# EasyEDA Pro project Tracking-Car.eprj

# Schematic Tracking-Car
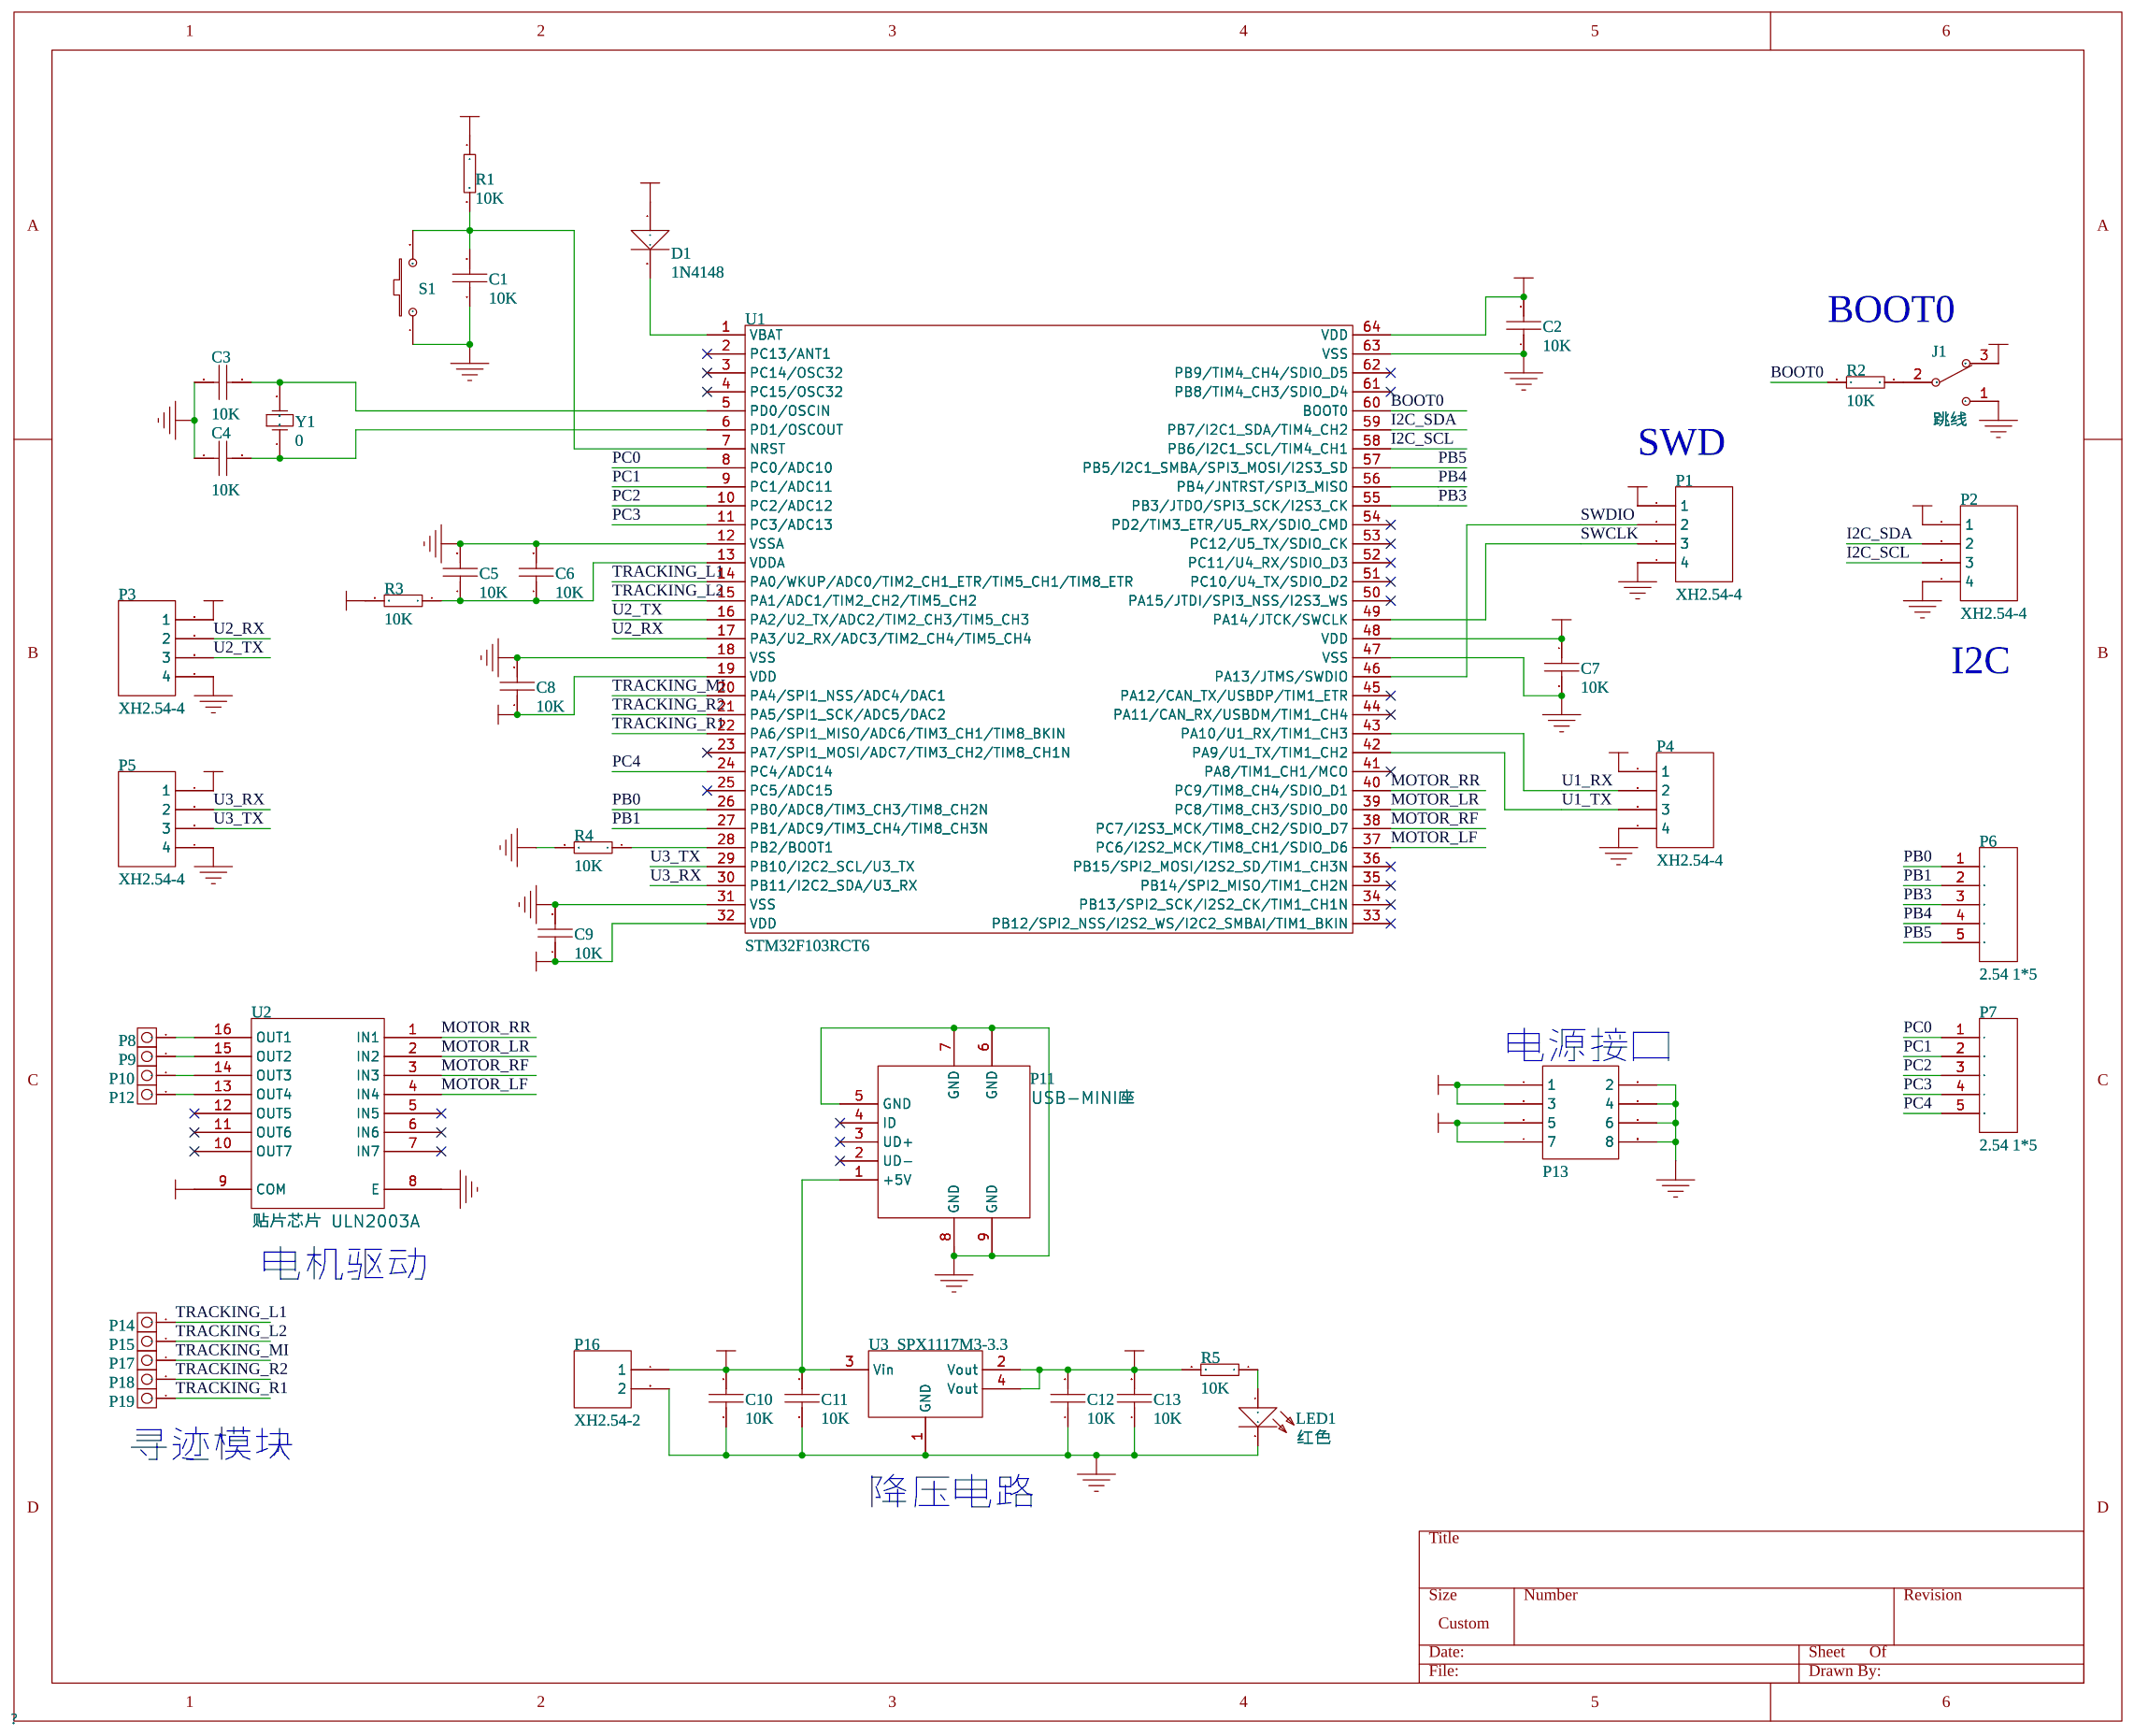
[diagram p0: schematic sheet]

## Parts
C1  10K  [R0805]
C2  10K  [R0805]
C3  10K  [R0805]
C4  10K  [R0805]
C5  10K  [R0805]
C6  10K  [R0805]
C7  10K  [R0805]
C8  10K  [R0805]
C9  10K  [R0805]
C10  10K  [R0805]
C11  10K  [R0805]
C12  10K  [R0805]
C13  10K  [R0805]
D1  1N4148  [Ƭ IN4148]
J1  跳线  [Ų 2.54 1*3]
LED1  红色  [LED0805]
P1  XH2.54-4  [VH2.54_4]
P2  XH2.54-4  [VH2.54_4]
P3  XH2.54-4  [VH2.54_4]
P4  XH2.54-4  [VH2.54_4]
P5  XH2.54-4  [VH2.54_4]
P6  2.54 1*5  [Ų 2.54 1*5]
P7  2.54 1*5  [Ų 2.54 1*5]
P8  DZ254R-11-01-63  [HDR-TH_1P-P2.54-V-M]
P9  DZ254R-11-01-63  [HDR-TH_1P-P2.54-V-M]
P10  DZ254R-11-01-63  [HDR-TH_1P-P2.54-V-M]
P11  USB-MINI座  [USB MINI DIP]
P12  DZ254R-11-01-63  [HDR-TH_1P-P2.54-V-M]
P13  双排插针 2.54 2*4  [HDR-TH_8P-P2.54-V-F-R2-C4-S2.54-1]
P14  DZ254R-11-01-63  [HDR-TH_1P-P2.54-V-M]
P15  DZ254R-11-01-63  [HDR-TH_1P-P2.54-V-M]
P16  XH2.54-2  [VH2.54_2]
P17  DZ254R-11-01-63  [HDR-TH_1P-P2.54-V-M]
P18  DZ254R-11-01-63  [HDR-TH_1P-P2.54-V-M]
P19  DZ254R-11-01-63  [HDR-TH_1P-P2.54-V-M]
R1  10K  [R0805]
R2  10K  [R0805]
R3  10K  [R0805]
R4  10K  [R0805]
R5  10K  [R0805]
S1  key  [ᴥ  6*3]
U1  STM32F103RCT6  [LQFP64]
U2  贴片芯片 ULN2003A  [SOIC16]
U3  SPX1117M3-3.3  [SOT223]
Y1  0  [BCY-W2/E4.7]

## Library data of the parts
C1-C13 = 10K: Supplier Part: C9900011271; JLCPCB Part Class: Extended Part; Supplier: LCSC; Design Item ID: 电容 贴片 0805; Library Name: Sch_Device_veryaz; 名称: 贴片电容; 封装: 0805; 单位: 个
D1 = 1N4148: 名称: 贴片二极管; 封装: 贴片; 单位: 个; Design Item ID: 二极管 贴片 1N4148; Library Name: Sch_Device_veryaz
J1 = 跳线: 单位: 个; 封装: 直插; 名称: 跳线插针; Design Item ID: 联结件 跳线端子 2.54-3; Library Name: Sch_Device_veryaz
LED1 = 红色: 名称: 贴片发光二极管; 封装: 0805; 单位: 个; Design Item ID: 二极管 贴片发光 0805; Library Name: Sch_Device_veryaz
P1-P5 = XH2.54-4: 名称: 联结件; 单位: 套; Design Item ID: 联结件 XH2.54-4; Library Name: Sch_Device_veryaz
P6 P7 = 2.54 1*5: 单位: 片; 封装: DIP; 名称: 单排插针; Design Item ID: 联结件 单排插针 2.54 1*5; Library Name: Sch_Device_veryaz
P8-P10 P12 P14 P15 P17-P19 = DZ254R-11-01-63: LCSC Part Name: 1x1P P=2.54mm 排针; Supplier Part: C2998932; Manufacturer: DEALON(德艺隆); Supplier Footprint: 插件,P=2.54mm; JLCPCB Part Class: Extended Part; Datasheet: https://atta.szlcsc.com/upload/public/pdf/source/20211231/575FA3133C71038A037ABECAE7869EE6.pdf; Supplier: LCSC; Design Item ID: 焊盘; Library Name: Sch_Device_veryaz; 单位: 个; 名称: 焊盘; 封装: 直插
P11 = USB-MINI座: 单位: 个; 封装: 440068; 名称: 联结件; Design Item ID: 联结件 USB-MINI座; Library Name: Sch_Device_veryaz
P13 = HDR-F_2.54_2x4: Supplier Part: C92271; Supplier Footprint: 插件; Design Item ID: 联结件 双排插针 2.54 2*4; Library Name: Sch_Device_veryaz; 名称: 联结件; 单位: 个; 封装: 直插
P16 = XH2.54-2: 名称: 联结件; 封装: VH3.96-2; 单位: 套; Design Item ID: 联结件 XH2.54-2; Library Name: Sch_Device_veryaz
R1-R5 = 10K: Supplier Part: C9900011271; JLCPCB Part Class: Extended Part; Supplier: LCSC; Design Item ID: 电阻 贴片 0805; Library Name: Sch_Device_veryaz; 名称: 贴片电阻; 封装: 0805; 单位: 个
S1 = key: 单位: 个; 名称: 开关; 封装: 直插 12*12*12; Design Item ID: 按键 轻触 3*6; Library Name: Sch_Device_veryaz
U1 = STM32F103RCT6: 单片机; 名称: 芯片; 单位: 片; Design Item ID: 贴片芯片 STM32F103RCT6; Library Name: Sch_Device_veryaz
U2 = 贴片芯片 ULN2003A: 单位: 片; 名称: 贴片芯片; Library Name: Sch_Device_veryaz
U3 = SPX1117M3-3.3: LDO; 名称: 贴片芯片; 单位: 个; Design Item ID: 贴片芯片 SPX1117M3-3.3; Library Name: Sch_Device_veryaz
Y1 = 0: 名称: 晶振; 封装: 直插矮; 单位: 个; Design Item ID: 晶振 直插矮; Library Name: Sch_Device_veryaz

## Nets
3.3V: C2.2 C7.1 C8.1 C9.1 C12.2 C13.2 D1.1(A) J1.3 P1.1 P2.1 P3.1 P4.1 P5.1 P13.1 P13.3 R1.1 R3.2 R5.2 U1.19(VDD) U1.32(VDD) U1.48(VDD) U1.64(VDD) U3.2(Vout) U3.4(Vout)
5V: C10.2 C11.2 P11.1(+5V) P13.5 P13.7 P16.1 U2.9(COM) U3.3(Vin)
GND: C1.1 C2.1 C3.1 C4.1 C5.2 C6.2 C7.2 C8.2 C9.2 C10.1 C11.1 C12.1 C13.1 J1.1 LED1.2(K) P1.4 P2.4 P3.4 P4.4 P5.4 P11.5(GND) P11.6(GND) P11.7(GND) P11.8(GND) P11.9(GND) P13.2 P13.4 P13.6 P13.8 P16.2 R4.2 S1.1 U1.12(VSSA) U1.18(VSS) U1.31(VSS) U1.47(VSS) U1.63(VSS) U2.8(E) U3.1(GND)
BOOT0: R2.2 U1.60(BOOT0)
I2C_SCL: P2.3 U1.58(PB6/I2C1_SCL/TIM4_CH1)
I2C_SDA: P2.2 U1.59(PB7/I2C1_SDA/TIM4_CH2)
MOTOR_LF: U1.37(PC6/I2S2_MCK/TIM8_CH1/SDIO_D6) U2.4(IN4)
MOTOR_LR: U1.39(PC8/TIM8_CH3/SDIO_D0) U2.2(IN2)
MOTOR_RF: U1.38(PC7/I2S3_MCK/TIM8_CH2/SDIO_D7) U2.3(IN3)
MOTOR_RR: U1.40(PC9/TIM8_CH4/SDIO_D1) U2.1(IN1)
PB0: P6.1 U1.26(PB0/ADC8/TIM3_CH3/TIM8_CH2N)
PB1: P6.2 U1.27(PB1/ADC9/TIM3_CH4/TIM8_CH3N)
PB3: P6.3 U1.55(PB3/JTDO/SPI3_SCK/I2S3_CK)
PB4: P6.4 U1.56(PB4/JNTRST/SPI3_MISO)
PB5: P6.5 U1.57(PB5/I2C1_SMBA/SPI3_MOSI/I2S3_SD)
PC0: P7.1 U1.8(PC0/ADC10)
PC1: P7.2 U1.9(PC1/ADC11)
PC2: P7.3 U1.10(PC2/ADC12)
PC3: P7.4 U1.11(PC3/ADC13)
PC4: P7.5 U1.24(PC4/ADC14)
SWCLK: P1.3 U1.49(PA14/JTCK/SWCLK)
SWDIO: P1.2 U1.46(PA13/JTMS/SWDIO)
TRACKING_L1: P14.1 U1.14(PA0/WKUP/ADC0/TIM2_CH1_ETR/TIM5_CH1/TIM8_ETR)
TRACKING_L2: P15.1 U1.15(PA1/ADC1/TIM2_CH2/TIM5_CH2)
TRACKING_MI: P17.1 U1.20(PA4/SPI1_NSS/ADC4/DAC1)
TRACKING_R1: P19.1 U1.22(PA6/SPI1_MISO/ADC6/TIM3_CH1/TIM8_BKIN)
TRACKING_R2: P18.1 U1.21(PA5/SPI1_SCK/ADC5/DAC2)
U1_RX: P4.2 U1.43(PA10/U1_RX/TIM1_CH3)
U1_TX: P4.3 U1.42(PA9/U1_TX/TIM1_CH2)
U2_RX: P3.2 U1.17(PA3/U2_RX/ADC3/TIM2_CH4/TIM5_CH4)
U2_TX: P3.3 U1.16(PA2/U2_TX/ADC2/TIM2_CH3/TIM5_CH3)
U3_RX: P5.2 U1.30(PB11/I2C2_SDA/U3_RX)
U3_TX: P5.3 U1.29(PB10/I2C2_SCL/U3_TX)
$1N727: C5.1 C6.1 R3.1 U1.13(VDDA)
$1N732: R4.1 U1.28(PB2/BOOT1)
$1N742: D1.2(K) U1.1(VBAT)
$1N823: LED1.1(A) R5.1
Net-(C1-2): C1.2 R1.2 S1.2 U1.7(NRST)
Net-(C3-2): C3.2 U1.5(PD0/OSCIN) Y1.2(OSC2)
Net-(C4-2): C4.2 U1.6(PD1/OSCOUT) Y1.1(OSC1)
Net-(J1-2): J1.2 R2.1
Net-(P8-1): P8.1 U2.16(OUT1)
Net-(P9-1): P9.1 U2.15(OUT2)
Net-(P10-1): P10.1 U2.14(OUT3)
Net-(P12-1): P12.1 U2.13(OUT4)

Not connected (* = marked no-connect by the designer): P11 2(UD-)* 3(UD+)* 4(ID)*; U1 2(PC13/ANT1)* 3(PC14/OSC32)* 4(PC15/OSC32)* 23(PA7/SPI1_MOSI/ADC7/TIM3_CH2/TIM8_CH1N)* 25(PC5/ADC15)* 33(PB12/SPI2_NSS/I2S2_WS/I2C2_SMBAI/TIM1_BKIN)* 34(PB13/SPI2_SCK/I2S2_CK/TIM1_CH1N)* 35(PB14/SPI2_MISO/TIM1_CH2N)* 36(PB15/SPI2_MOSI/I2S2_SD/TIM1_CH3N)* 41(PA8/TIM1_CH1/MCO)* 44(PA11/CAN_RX/USBDM/TIM1_CH4)* 45(PA12/CAN_TX/USBDP/TIM1_ETR)* 50(PA15/JTDI/SPI3_NSS/I2S3_WS)* 51(PC10/U4_TX/SDIO_D2)* 52(PC11/U4_RX/SDIO_D3)* 53(PC12/U5_TX/SDIO_CK)* 54(PD2/TIM3_ETR/U5_RX/SDIO_CMD)* 61(PB8/TIM4_CH3/SDIO_D4)* 62(PB9/TIM4_CH4/SDIO_D5)*; U2 5(IN5)* 6(IN6)* 7(IN7)* 10(OUT7)* 11(OUT6)* 12(OUT5)*

## Notes on the sheet
- BOOT0
- SWD
- I2C
- 电源接口
- 电机驱动
- 寻迹模块
- 降压电路

# Board Tracking-Car
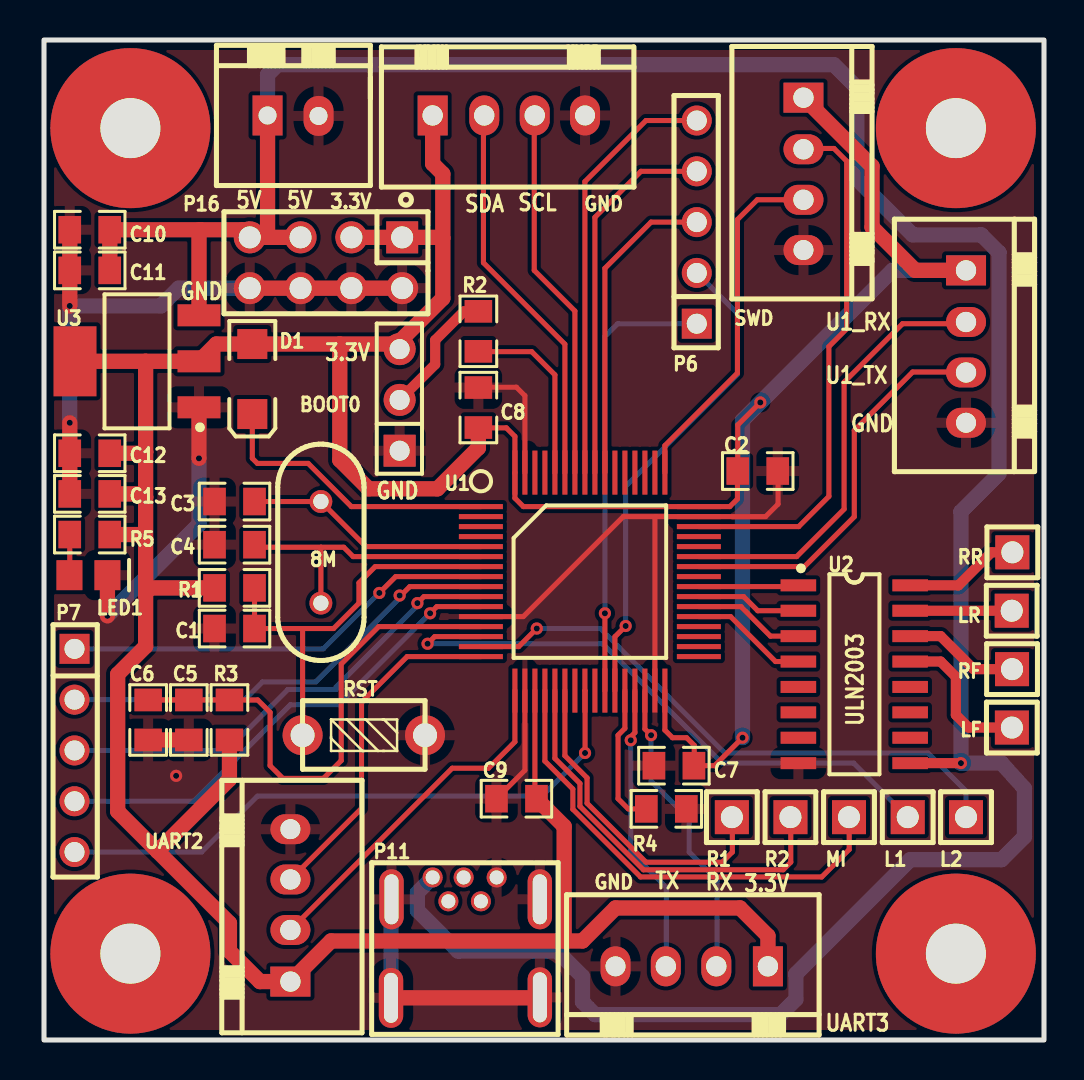
[diagram p1: board, top side]
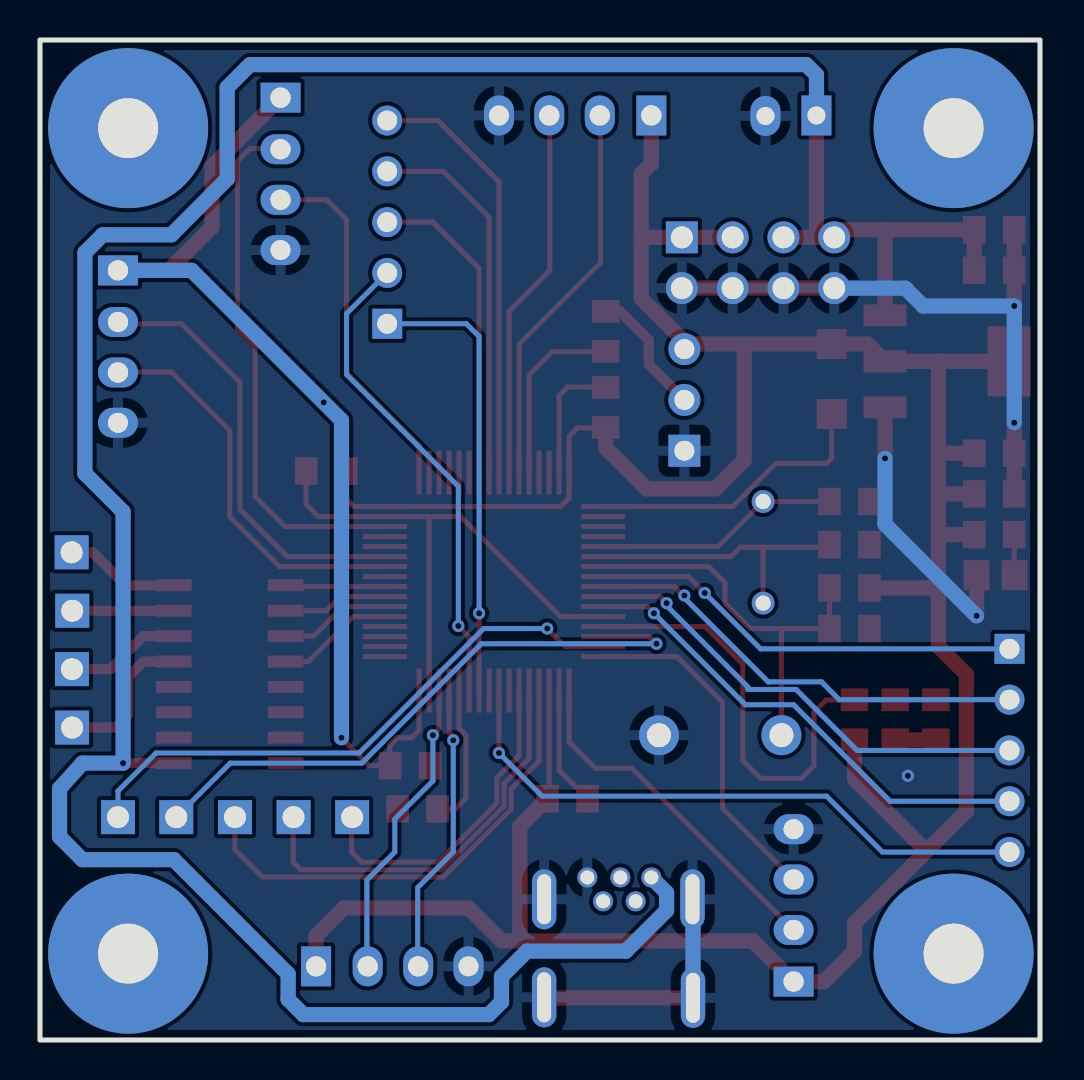
[diagram p2: board, bottom side, seen from below]

Outline 50 x 50 mm; copper layers: Top Layer, Bottom Layer. Coordinates in mm from the lower left corner of the outline.
Outline path: rectangle 0,50 50,0
Stack: Top Layer 0.035mm / Dielectric1 1.51mm FR4 er 4.5 / Bottom Layer 0.035mm

## Design rules (mm)
template: 自定义配置
spacing copperThickness1oz (default): track to track 0.102, other pairs 0.152 to 0.3
spacing copperThickness2oz: track to track 0.203, other pairs 0.152 to 0.3
track width copperThickness1oz (default): min 0.127, default 0.254, max 2.54
track width copperThickness2oz: min 0.203, default 0.254, max 2.54
track width VCC: min 0.254, default 0.508, max 2.54
track width GND: min 0.254, default 0.508, max 2.54
differential pair differentialPair (default): width min 0.127, default 0.254, max 2.54; gap min 0.152, default 0.152
via viaSize (default): diameter min 0.5, default 0.61, max 10; hole min 0.3, default 0.305, max 6.299
net 3.3V uses VCC
net 5V uses VCC

## Placement (name value [footprint] x y rotation side)
3.3V  双排插针 2.54 2*4  [HDR-TH_8P-P2.54-V-F-R2-C4-S2.54-1]  14.1 38.86 180 top
8M  0  [BCY-W2/E4.7]  13.84 21.84 90 top
BOOT0  跳线  [Ų 2.54 1*3]  17.78 29.46 90 top
C1  10K  [R0805]  9.53 20.57 0 top
C2  10K  [R0805]  35.69 28.45 180 top
C3  10K  [R0805]  9.53 26.92 0 top
C4  10K  [R0805]  9.53 24.77 0 top
C5  10K  [R0805]  7.24 16 270 top
C6  10K  [R0805]  5.21 16 270 top
C7  10K  [R0805]  31.5 13.72 180 top
C8  10K  [R0805]  21.72 31.62 90 top
C9  10K  [R0805]  23.62 12.06 180 top
C10  10K  [R0805]  2.29 40.51 0 top
C11  10K  [R0805]  2.29 38.48 0 top
C12  10K  [R0805]  2.29 29.34 0 top
C13  10K  [R0805]  2.29 27.3 0 top
D1  1N4148  [Ƭ IN4148]  10.41 34.8 270 top
GND  -  [VH2.54_4]  36.19 3.68 0 top
GND#2  -  [VH2.54_4]  19.43 46.23 180 top
L1  DZ254R-11-01-63  [HDR-TH_1P-P2.54-V-M]  43.19 11.14 0 top
L2  DZ254R-11-01-63  [HDR-TH_1P-P2.54-V-M]  46.1 11.14 0 top
LED1  红色  [LED0805]  1.27 23.24 0 top
LF  DZ254R-11-01-63  [HDR-TH_1P-P2.54-V-M]  48.39 15.62 0 top
LR  DZ254R-11-01-63  [HDR-TH_1P-P2.54-V-M]  48.39 21.46 0 top
MI  DZ254R-11-01-63  [HDR-TH_1P-P2.54-V-M]  40.25 11.14 0 top
NOREF  -  [Pad_e104]  4.32 45.59 0 top
NOREF#2  -  [Pad_e110]  45.59 45.59 0 top
NOREF#3  -  [Pad_e112]  4.32 4.32 0 top
NOREF#4  -  [Pad_e111]  45.59 4.32 0 top
P6  2.54 1*5  [Ų 2.54 1*5]  32.64 35.81 90 top
P7  2.54 1*5  [Ų 2.54 1*5]  1.52 19.56 270 top
P11  USB-MINI座  [USB MINI DIP]  19.43 8.13 90 top
P16  XH2.54-2  [VH2.54_2]  11.18 46.23 180 top
R1  10K  [R0805]  9.53 22.61 0 top
R1#2  -  [HDR-TH_1P-P2.54-V-M]  34.39 11.14 0 top
R2  10K  [R0805]  21.72 35.43 270 top
R2#2  -  [HDR-TH_1P-P2.54-V-M]  37.32 11.14 0 top
R3  10K  [R0805]  9.27 16 270 top
R4  10K  [R0805]  31.12 11.56 0 top
R5  10K  [R0805]  2.29 25.27 0 top
RF  DZ254R-11-01-63  [HDR-TH_1P-P2.54-V-M]  48.4 18.54 0 top
RR  DZ254R-11-01-63  [HDR-TH_1P-P2.54-V-M]  48.42 24.38 0 top
RST  key  [ᴥ  6*3]  19.05 15.24 270 top
SWD  XH2.54-4  [VH2.54_4]  37.97 47.12 90 top
U1  STM32F103RCT6  [LQFP64]  21.84 26.67 0 top
U2  贴片芯片 ULN2003A  [SOIC16]  37.85 22.73 270 top
U3  SPX1117M3-3.3  [SOT223]  7.75 31.62 90 top
UART2  XH2.54-4  [VH2.54_4]  12.32 2.92 270 top
USART1  XH2.54-4  [VH2.54_4]  46.1 38.48 90 top

## Footprints (pads in the part's own frame, mm; a bottom-side part is the same pattern mirrored in y, then rotated)
BCY-W2/E4.7
  round 1.143 hole 0.762: 1(0,0) 2(5.08,0)
HDR-TH_1P-P2.54-V-M
  rect 1.7x1.7 hole 1.1: 1(0,0)
HDR-TH_8P-P2.54-V-F-R2-C4-S2.54-1
  rect 1.6x1.6 hole 1.1: 1(-3.81,-1.27)
  round 1.6 hole 1.1: 2(-3.81,1.27) 3(-1.27,-1.27) 4(-1.27,1.27) 5(1.27,-1.27) 6(1.27,1.27) 7(3.81,-1.27) 8(3.81,1.27)
LED0805
  rect 1.3x1.5 smd: 1(0,0) 2(1.9,0)
LQFP64
  rect 2.2x0.254 smd: 1(0,0) 2(0,-0.5) 3(0,-1) 4(0,-1.5) 5(0,-2) 6(0,-2.5) 7(0,-3) 8(0,-3.5) 9(0,-4) 10(0,-4.5) 11(0,-5) 12(0,-5.5) 13(0,-6) 14(0,-6.5) 15(0,-7) 16(0,-7.5) 33(10.9,-7.5) 34(10.9,-7) 35(10.9,-6.5) 36(10.9,-6) 37(10.9,-5.5) 38(10.9,-5) 39(10.9,-4.5) 40(10.9,-4) 41(10.9,-3.5) 42(10.9,-3) 43(10.9,-2.5) 44(10.9,-2) 45(10.9,-1.5) 46(10.9,-1) 47(10.9,-0.5) 48(10.9,0)
  rect 0.254x2.2 smd: 17(1.7,-9.2) 18(2.2,-9.2) 19(2.7,-9.2) 20(3.2,-9.2) 21(3.7,-9.2) 22(4.2,-9.2) 23(4.7,-9.2) 24(5.2,-9.2) 25(5.7,-9.2) 26(6.2,-9.2) 27(6.7,-9.2) 28(7.2,-9.2) 29(7.7,-9.2) 30(8.2,-9.2) 31(8.7,-9.2) 32(9.2,-9.2) 49(9.2,1.7) 50(8.7,1.7) 51(8.2,1.7) 52(7.7,1.7) 53(7.2,1.7) 54(6.7,1.7) 55(6.2,1.7) 56(5.7,1.7) 57(5.2,1.7) 58(4.7,1.7) 59(4.2,1.7) 60(3.7,1.7) 61(3.2,1.7) 62(2.7,1.7) 63(2.2,1.7) 64(1.7,1.7)
Pad_e104
  round 8 hole 3: 1(0,0)
Pad_e110
  round 8 hole 3: 2(0,0)
Pad_e111
  round 8 hole 3: 3(0,0)
Pad_e112
  round 8 hole 3: 4(0,0)
R0805
  rect 1.133x1.377 smd: 1(-1,0) 2(1,0)
SOIC16
  rect 0.6x1.778 smd: 1(0,-0.127) 2(1.27,-0.127) 3(2.54,-0.127) 4(3.81,-0.127) 5(5.08,-0.127) 6(6.35,-0.127) 7(7.62,-0.127) 8(8.89,-0.127) 9(8.89,5.461) 10(7.62,5.461) 11(6.35,5.461) 12(5.08,5.461) 13(3.81,5.461) 14(2.54,5.461) 15(1.27,5.461) 16(0,5.461)
SOT223
  rect 1.1x2.15 smd: 1(0.011,-0.001) 2(2.312,-0.001) 3(4.612,-0.001)
  rect 3.5x2.15 smd: 4(2.312,6.199)
USB MINI DIP
  round 1 hole 0.7: 1(0,0) 2(-1.194,-0.787) 3(0,-1.55) 4(-1.194,-2.413) 5(0,-3.2)
  oval 3x1.22 hole 2.5x0.7: 6(-1.093,-5.359) 7(-5.995,-5.36) 8(-1.093,2.057) 9(-6.02,2.082)
VH2.54_2
  rect 1.5x2 hole 0.9: 1(0,0)
  oval 1.5x2 hole 0.9: 2(-2.55,0.025)
VH2.54_4
  rect 1.5x2 hole 1.016: 1(0,0)
  oval 1.5x2 hole 1.016: 2(-2.58,0) 3(-5.106,0)
  oval 1.5x2 hole 1: 4(-7.62,0)
Ų 2.54 1*3
  rect 1.6x1.6 hole 1: 1(0,0)
  round 1.6 hole 1: 2(2.54,0) 3(5.08,0)
Ų 2.54 1*5
  rect 1.5x1.5 hole 1: 1(0,0)
  round 1.5 hole 1: 2(2.54,0) 3(5.08,0) 4(7.62,0) 5(10.16,0)
Ƭ IN4148
  rect 1.5x1.5 smd: 1(0,0) 2(3.5,0)
ᴥ  6*3
  round 2 hole 1.2: 1(0,0) 2(0,-6.122)

## Nets
3.3V: 3.3V.1 3.3V.3 BOOT0.3 C2.2 C7.1 C8.1 C9.1 C12.2 C13.2 D1.1 GND.1 GND#2.1 R1.1 R3.2 R5.2 SWD.1 U1.19 U1.32 U1.48 U1.64 U3.2 U3.4 UART2.1 USART1.1
5V: 3.3V.5 3.3V.7 C10.2 C11.2 P11.1 P16.1 U2.9 U3.3
GND: 3.3V.2 3.3V.4 3.3V.6 3.3V.8 BOOT0.1 C1.1 C2.1 C3.1 C4.1 C5.2 C6.2 C7.2 C8.2 C9.2 C10.1 C11.1 C12.1 C13.1 GND.4 GND#2.4 LED1.2 P11.5 P11.6 P11.7 P11.8 P11.9 P16.2 R4.2 RST.1 SWD.4 U1.12 U1.18 U1.31 U1.47 U1.63 U2.8 U3.1 UART2.4 USART1.4
BOOT0: R2.2 U1.60
I2C_SCL: GND#2.3 U1.58
I2C_SDA: GND#2.2 U1.59
MOTOR_LF: U1.37 U2.4
MOTOR_LR: U1.39 U2.2
MOTOR_RF: U1.38 U2.3
MOTOR_RR: U1.40 U2.1
PB0: P6.1 U1.26
PB1: P6.2 U1.27
PB3: P6.3 U1.55
PB4: P6.4 U1.56
PB5: P6.5 U1.57
PC0: P7.1 U1.8
PC1: P7.2 U1.9
PC2: P7.3 U1.10
PC3: P7.4 U1.11
PC4: P7.5 U1.24
SWCLK: SWD.3 U1.49
SWDIO: SWD.2 U1.46
TRACKING_L1: L1.1 U1.14
TRACKING_L2: L2.1 U1.15
TRACKING_MI: MI.1 U1.20
TRACKING_R1: R1#2.1 U1.22
TRACKING_R2: R2#2.1 U1.21
U1_RX: U1.43 USART1.2
U1_TX: U1.42 USART1.3
U2_RX: U1.17 UART2.2
U2_TX: U1.16 UART2.3
U3_RX: GND.2 U1.30
U3_TX: GND.3 U1.29
$1N727: C5.1 C6.1 R3.1 U1.13
$1N732: R4.1 U1.28
$1N739: C1.2 R1.2 RST.2 U1.7
$1N742: D1.2 U1.1
$1N759: RR.1 U2.16
$1N760: LR.1 U2.15
$1N761: RF.1 U2.14
$1N762: LF.1 U2.13
$1N823: LED1.1 R5.1
$1N832: 8M.1 C4.2 U1.6
$1N833: 8M.2 C3.2 U1.5
$1N910: BOOT0.2 R2.1

Pads without a net: NOREF 1; NOREF#2 2; NOREF#3 4; NOREF#4 3; P11 2 3 4; U1 2 3 4 23 25 33 34 35 36 41 44 45 50 51 52 53 54 61 62; U2 5 6 7 10 11 12

## Via types
v1: diameter 0.61, hole 0.305, Top Layer to Bottom Layer, 19 vias

## Routing (per net, layer and track width the routed paths; a pad name or vN(x,y) marks a point on that pad's centre or on a via; arc(x,y) is an arc through that point)
3.3V: length 215.3
  Top Layer w0.254: v1(35.81,31.88) 34.69,30.75 C2.2 34.67,28.43 34.67,27.05 34.29,26.67 U1.48 23.97,26.67 23.54,27.09 23.54,30.18 23.11,30.61 21.73,30.61 C8.1 ; 24.54,12.14 24.54,17.47 ; 31.04,17.47 31.04,15.49 31.43,15.11 32.13,15.11 32.51,14.73 32.51,13.73 C7.1 33.53,13.72 v1(34.93,15.11)
  Top Layer w0.762: 5.08,27.14 4.91,27.3 C13.2 ; 5.08,27.14 5.08,29.41 ; 5.08,27.14 5.08,25.08 ; C12.2 5.01,29.34 5.08,29.41 ; 19.94,40.1 19.94,37.08 17.78,34.92 BOOT0.3 17.53,34.8 14.79,34.8 ; 19.94,40.1 19.94,43.31 19.43,43.81 GND#2.1 ; 19.94,40.1 19.91,40.13 3.3V.1 3.3V.3 ; 5.08,25.08 5.08,22.36 ; 5.08,25.08 4.88,25.27 R5.2 ; 5.08,22.36 5.33,22.61 R1.1 ; 5.08,22.36 5.08,19.69 3.68,18.29 3.68,11.43 5.68,9.44 ; 5.68,9.44 9.27,5.84 9.27,4.44 10.8,2.92 UART2.1 14.35,4.95 26.01,4.95 ; 5.68,9.44 9.27,13.03 R3.2 ; U3.4 5.08,33.93 ; 5.08,33.93 5.08,29.41 ; 5.08,33.93 U3.2 8.61,34.8 D1.1 14.79,34.8 ; GND.1 36.19,5.21 34.8,6.6 28.58,6.6 26.92,4.95 26.01,4.95 ; 14.79,34.8 14.79,29 16.23,27.56 19.67,27.56 21.72,29.61 C8.1 ; 26.01,4.95 26.01,10.68 C9.1 ; SWD.1 41.4,43.69 41.4,40.64 43.56,38.48 USART1.1
  Bottom Layer w0.762: v1(34.93,15.11) 34.93,30.99 42.42,38.48 USART1.1
5V: length 142.2
  Top Layer w0.508: U2.9 v1(45.85,13.84)
  Top Layer w0.762: 11.22,40.13 11.18,40.18 P16.1 ; 11.22,40.13 3.3V.5 ; 11.22,40.13 3.3V.7 9.91,40.51 7.81,40.51 ; C11.2 C10.2 7.81,40.51 ; 7.81,40.51 7.75,40.45 U3.3
  Bottom Layer w0.762: P11.1 18.67,7.37 18.67,6.48 20.7,4.44 25.65,4.44 26.92,3.17 26.92,1.91 27.56,1.27 36.83,1.27 37.59,2.03 37.59,3.3 43.31,9.02 47.88,9.02 49.02,10.16 49.02,12.57 47.88,13.84 v1(45.85,13.84) 45.85,26.42 47.75,28.32 47.75,39.37 46.86,40.26 43.43,40.26 40.64,43.05 40.64,47.62 39.5,48.77 11.68,48.77 11.18,48.26 P16.1
GND: length 98.9
  Top Layer w0.254: C8.2 21.73,32.64 23.62,32.64 24.04,32.22 24.04,28.37 ; C9.2 24.04,13.49 24.04,17.47 ; 30.54,17.47 30.54,26.12 30.6,26.17 ; 30.6,26.17 28.96,26.17 23.96,21.17 U1.12 ; 30.6,26.17 U1.47 36.08,26.17 36.7,26.8 36.7,28.43 C2.1
  Top Layer w0.762: LED1.2 v1(3.17,21.21) ; P11.9 24.77,2.11 P11.7 ; 3.3V.2 3.3V.4 3.3V.6 3.3V.8 ; v1(7.75,29.08) 7.75,31.63 ; C10.1 C11.1 v1(1.29,36.7) ; v1(1.29,30.86) C12.1 C13.1 ; C6.2 C5.2
  Bottom Layer w0.762: v1(7.75,29.08) 7.75,25.79 v1(3.17,21.21) ; 3.3V.8 6.73,37.59 5.84,36.7 v1(1.29,36.7) v1(1.29,30.86) ; P11.9 17.35,7.01 17.37,7.03
  vias: v1(6.6,13.21)
BOOT0: length 9.2
  Top Layer w0.254: 25.54,28.37 25.54,33.26 24.38,34.42 21.73,34.42 R2.2
I2C_SCL: length 18.7
  Top Layer w0.254: 26.54,28.37 26.54,36.45 24.51,38.48 24.51,46.2 GND#2.3
I2C_SDA: length 19.6
  Top Layer w0.254: 26.04,28.37 26.04,34.79 21.97,38.86 21.97,46.19 GND#2.2
MOTOR_LF: length 5.3
  Top Layer w0.254: 37.08,18.92 36.58,18.92 34.33,21.17 U1.37
MOTOR_LR: length 4.6
  Top Layer w0.254: 37.08,21.46 35.69,21.46 34.98,22.17 U1.39
MOTOR_RF: length 5
  Top Layer w0.254: 37.08,20.19 36.32,20.19 34.84,21.67 U1.38
MOTOR_RR: length 4.4
  Top Layer w0.254: 37.08,22.73 37.02,22.67 U1.40
PB0: length 22.6
  Top Layer w0.254: 28.04,17.47 v1(28.04,21.34)
  Bottom Layer w0.254: v1(28.04,21.34) 28.04,35.18 28.68,35.81 P6.1
PB1: length 24.3
  Top Layer w0.254: v1(29.08,20.7) 28.54,20.16 28.54,17.47
  Bottom Layer w0.254: v1(29.08,20.7) 29.08,27.69 34.67,33.27 34.67,36.32 P6.2
PB3: length 15.8
  Top Layer w0.254: P6.3 30.35,40.89 28.04,38.58 28.04,28.37
PB4: length 18.8
  Top Layer w0.254: 27.54,28.37 27.54,41.13 29.84,43.43 P6.4
PB5: length 21.4
  Top Layer w0.254: 27.04,28.37 27.04,42.92 30.1,45.97 P6.5
PC0: length 21.8
  Top Layer w0.254: v1(16.76,22.35) 17.58,23.17 U1.8
  Bottom Layer w0.254: v1(16.76,22.35) 13.97,19.56 P7.1
PC1: length 22.7
  Top Layer w0.254: U1.9 18.29,22.67 17.84,22.22 v1(17.78,22.22)
  Bottom Layer w0.254: v1(17.78,22.22) 17.78,22.1 13.59,17.91 10.92,17.91 10.03,17.02 P7.2
PC2: length 23.7
  Top Layer w0.254: U1.10 19,22.17 v1(18.67,21.84)
  Bottom Layer w0.254: P7.3 9.14,14.48 12.19,17.53 14.61,17.53 14.61,17.65 18.67,21.72 v1(18.67,21.84)
PC3: length 24.4
  Top Layer w0.254: v1(19.3,21.34) 19.64,21.67 U1.11
  Bottom Layer w0.254: v1(19.3,21.34) 14.73,16.76 12.32,16.76 7.49,11.94 P7.4
PC4: length 30.7
  Top Layer w0.254: 27.04,17.47 27.05,17.46 v1(27.05,14.35)
  Bottom Layer w0.254: v1(27.05,14.35) 24.89,12.19 10.67,12.19 7.87,9.4 P7.5
SWCLK: length 17.9
  Top Layer w0.254: SWD.3 35.66,42.01 34.67,41.02 34.67,33.34 31.04,29.72 31.04,28.37
SWDIO: length 26.7
  Top Layer w0.254: U1.46 37.74,25.67 39.24,27.18 39.24,34.67 40.13,35.56 40.13,43.94 39.5,44.58 38.01,44.58 SWD.2
TRACKING_L1: length 30.4
  Top Layer w0.254: v1(19.18,19.81) 19.53,20.17 U1.14
  Bottom Layer w0.254: v1(19.18,19.81) 27.94,19.81 33.91,13.84 40.49,13.84 L1.1
TRACKING_L2: length 29.3
  Top Layer w0.254: v1(24.64,20.57) 23.73,19.67 U1.15
  Bottom Layer w0.254: v1(24.64,20.57) 27.81,20.57 34.04,14.35 44.2,14.35 46.1,12.45 L2.1
TRACKING_MI: length 23.9
  Top Layer w0.254: MI.1 40.26,11.13 40.26,9.52 38.89,8.15 29.82,8.15 26.44,11.54 26.44,12.55 25.04,13.94 25.04,17.47
TRACKING_R1: length 16.5
  Top Layer w0.254: 26.04,17.47 26.04,14.22 27.15,13.11 27.15,11.84 30.1,8.89 33.91,8.89 34.42,9.4 34.42,11.12 R1#2.1
TRACKING_R2: length 20.6
  Top Layer w0.254: 25.54,17.47 25.54,14.08 26.8,12.83 26.8,11.68 29.97,8.51 36.96,8.51 37.34,8.89 37.34,11.12 R2#2.1
U1_RX: length 21.9
  Top Layer w0.254: USART1.2 46.01,35.81 42.93,35.81 40,32.89 40,26.54 37.63,24.17 U1.43
U1_TX: length 19.9
  Top Layer w0.254: USART1.3 46.08,33.4 43.43,33.4 40.51,30.48 40.51,26.16 38.02,23.67 U1.42
U2_RX: length 17.7
  Top Layer w0.254: UART2.2 20.41,13.59 22.22,13.59 23.54,14.91 23.54,17.47
U2_TX: length 17.3
  Top Layer w0.254: UART2.3 15.88,11.58 15.88,16.89 18.15,19.17 U1.16
U3_RX: length 15.3
  Top Layer w0.254: 30.04,17.47 30.04,15.55 v1(30.35,15.24)
  Bottom Layer w0.254: GND.2 33.66,3.72 33.66,8 32.26,9.4 32.26,11.05 30.35,12.95 v1(30.35,15.24)
U3_TX: length 14.6
  Top Layer w0.254: v1(29.34,14.99) 29.34,15.16 29.54,15.37 29.54,17.47
  Bottom Layer w0.254: v1(29.34,14.99) 29.34,9.4 31.12,7.62 31.12,3.71 GND.3
$1N727: length 25.8
  Top Layer w0.254: C6.1 C5.1 R3.1 10.68,17 11.3,16.38 11.3,13.72 11.94,13.08 13.97,13.08 14.86,13.97 14.86,18.8 16.73,20.67 U1.13
$1N732: length 7.2
  Top Layer w0.254: 29.04,17.47 29.04,15.58 28.7,15.24 28.7,12.06 29.21,11.56 R4.1
$1N739: length 20.6
  Top Layer w0.254: 12.92,20.57 C1.2 R1.2 ; 12.92,20.57 14.48,20.57 15.75,21.84 15.75,22.86 16.56,23.67 U1.7 ; 12.92,20.57 12.93,20.57 RST.2
$1N742: length 14.6
  Top Layer w0.254: U1.1 15.37,26.67 13.21,28.83 10.67,28.83 10.41,29.08 D1.2
$1N759: length 5.8
  Top Layer w0.508: RR.1 47.37,24.38 45.72,22.73 U2.16
$1N760: length 5.1
  Top Layer w0.508: 43.31,21.46 LR.1
$1N761: length 5.8
  Top Layer w0.508: RF.1 46.48,18.54 44.83,20.19 U2.14
$1N762: length 7.6
  Top Layer w0.508: U2.13 44.83,18.92 45.59,18.16 45.59,16.26 46.23,15.62 LF.1
$1N823: length 2
  Top Layer w0.254: R5.1 1.29,23.26 LED1.1
$1N832: length 14.4
  Top Layer w0.254: 13.84,24.64 14.99,24.64 15.45,24.17 U1.6 ; 13.84,24.64 8M.1 ; 13.84,24.64 10.65,24.64 C4.2
$1N833: length 12.3
  Top Layer w0.254: U1.5 16.1,24.67 8M.2 C3.2
$1N910: length 6.5
  Top Layer w0.508: BOOT0.2 19.56,33.78 19.56,34.99 21,36.43 R2.1

## Copper pours and planes (outline as drawn; the poured copper is in the pictures)
GND on Top Layer: 0,50 50,50 50,0 0,0
GND on Bottom Layer: 0,50 50,50 50,0 0,0

## Text on the board
Top Silkscreen Layer: TX | RX | 3.3V | UART3 | ULN2003 | GND | 5V | SDA | SCL | U1_RX | U1_TX
